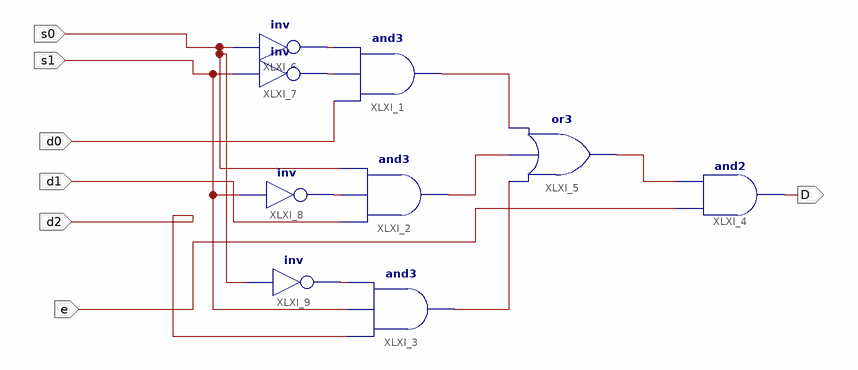
[diagram p0: schematic sheet 1]
// Xilinx ISE schematic test2.sch (artix7) as structural Verilog: 9 symbols, 7 ports
module test2 (
  input  d0,
  input  d1,
  input  d2,
  input  e,
  input  s0,
  input  s1,
  output D
);

  wire XLXN_8, XLXN_18, XLXN_19, XLXN_20, XLXN_22, XLXN_23, XLXN_24, XLXN_30;

  and XLXI_1 (XLXN_8, d0, XLXN_30, XLXN_20);
  and XLXI_2 (XLXN_18, d1, XLXN_22, s0);
  and XLXI_3 (XLXN_19, d2, s1, XLXN_23);
  and XLXI_4 (D, e, XLXN_24);
  or XLXI_5 (XLXN_24, XLXN_19, XLXN_18, XLXN_8);
  not XLXI_6 (XLXN_20, s0);
  not XLXI_7 (XLXN_30, s1);
  not XLXI_8 (XLXN_22, s1);
  not XLXI_9 (XLXN_23, s0);
endmodule
